# Altium project PCIE Layback.PrjPCB
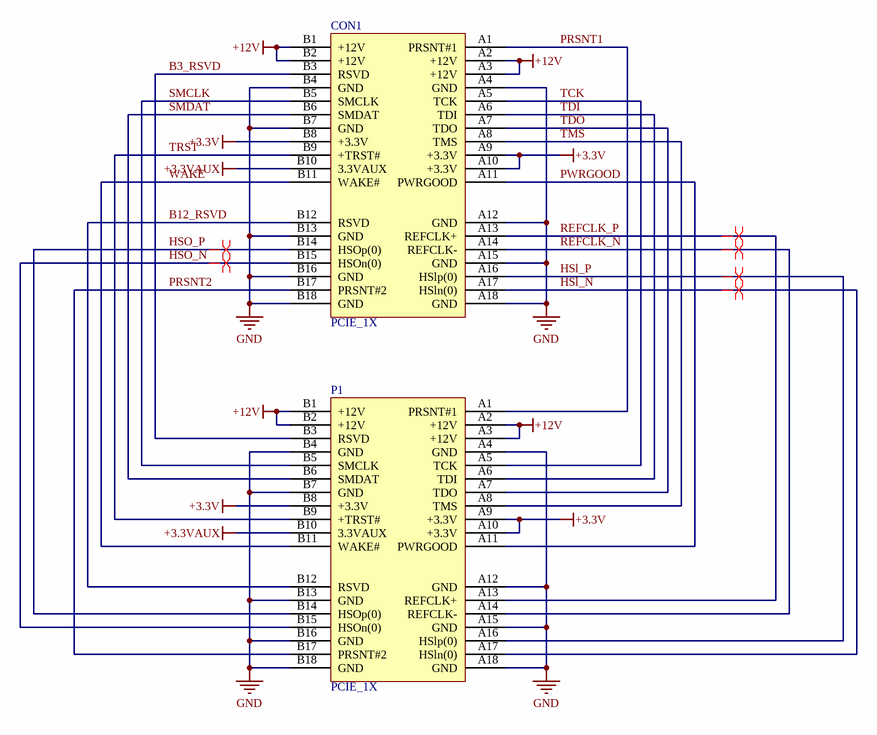
[diagram p0: PCIE.SchDoc]
1 sheet, 2 parts. Net scope: global (net labels, ports and power ports of the same name join across sheets).
Board file: PCIE.PcbDoc

## Sheet PCIE.SchDoc
size B

### Parts
CON1  PCIE_1X  [PCIE_1X_EDGE]
P1  PCIE_1X  [NWE18DHHN-T931]

### Nets
+3.3V: CON1.A9(+3.3V) CON1.A10(+3.3V) CON1.B8(+3.3V) P1.A9(+3.3V) P1.A10(+3.3V) P1.B8(+3.3V)
+3.3VAUX: CON1.B10(3.3VAUX) P1.B10(3.3VAUX)
+12V: CON1.A2(+12V) CON1.A3(+12V) CON1.B1(+12V) CON1.B2(+12V) P1.A2(+12V) P1.A3(+12V) P1.B1(+12V) P1.B2(+12V)
GND: CON1.A4(GND) CON1.A12(GND) CON1.A15(GND) CON1.A18(GND) CON1.B4(GND) CON1.B7(GND) CON1.B13(GND) CON1.B16(GND) CON1.B18(GND) P1.A4(GND) P1.A12(GND) P1.A15(GND) P1.A18(GND) P1.B4(GND) P1.B7(GND) P1.B13(GND) P1.B16(GND) P1.B18(GND)
B3_RSVD: CON1.B3(RSVD) P1.B3(RSVD)
B12_RSVD: CON1.B12(RSVD) P1.B12(RSVD)
HSl_N: CON1.A17(HSln(0)) P1.A17(HSln(0))
HSl_P: CON1.A16(HSlp(0)) P1.A16(HSlp(0))
HSO_N: CON1.B15(HSOn(0)) P1.B15(HSOn(0))
HSO_P: CON1.B14(HSOp(0)) P1.B14(HSOp(0))
PRSNT1: CON1.A1(PRSNT#1) P1.A1(PRSNT#1)
PRSNT2: CON1.B17(PRSNT#2) P1.B17(PRSNT#2)
PWRGOOD: CON1.A11(PWRGOOD) P1.A11(PWRGOOD)
REFCLK_N: CON1.A14(REFCLK-) P1.A14(REFCLK-)
REFCLK_P: CON1.A13(REFCLK+) P1.A13(REFCLK+)
SMCLK: CON1.B5(SMCLK) P1.B5(SMCLK)
SMDAT: CON1.B6(SMDAT) P1.B6(SMDAT)
TCK: CON1.A5(TCK) P1.A5(TCK)
TDI: CON1.A6(TDI) P1.A6(TDI)
TDO: CON1.A7(TDO) P1.A7(TDO)
TMS: CON1.A8(TMS) P1.A8(TMS)
TRST: CON1.B9(+TRST#) P1.B9(+TRST#)
WAKE: CON1.B11(WAKE#) P1.B11(WAKE#)

### Layout directives
differential pair: HSl_N, HSl_P, HSO_N, HSO_P, REFCLK_N, REFCLK_P

### Notes on the sheet
- http://www.tangentaudio.com/
- Tangent Audio